# Altium schematic sheet Comms.SchDoc
size A
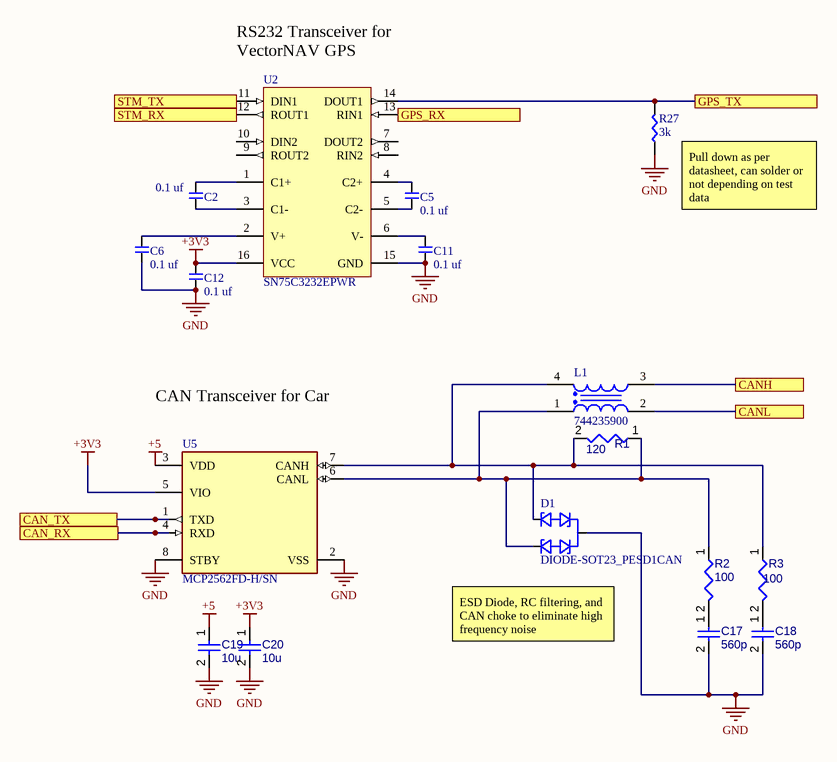
[diagram p0: Comms.SchDoc]

## Parts
C2  0.1 uf  [CAP-0603]
C5  0.1 uf  [CAP-0603]
C6  0.1 uf  [CAP-0603]
C11  0.1 uf  [CAP-0603]
C12  0.1 uf  [CAP-0603]
C17  560p  [CAPC0603(1608)100_L]
C18  560p  [CAPC0603(1608)100_L]
C19  10u  [CAPC0603(1608)100_L]
C20  10u  [CAPC0603(1608)100_L]
D1  DIODE-SOT23_PESD1CAN  [SOT23]
L1  744235900  [WE-CNSW_1812]
R1  120  [RESC0805(2012)_L]
R2  100  [RESC0805(2012)_L]
R3  100  [RESC0805(2012)_L]
R27  3k  [RES-0603]
U2  SN75C3232EPWR  [PW0016A_M]
U5  MCP2562FD-H/SN  [FP-C04-057-SN-MFG]

## Ports
CAN_RX, CAN_TX, CANH, CANL, GPS_RX, GPS_TX, STM_RX, STM_TX

## Nets
+3V3: C12.1 C20.1 U2.16(VCC) U5.5(VIO)
+5: C19.1 U5.3(VDD)
GND: C6.2 C11.2 C12.2 C17.2 C18.2 C19.2 C20.2 D1.3(G) R27.1 U2.15(GND) U5.2(VSS) U5.8(STBY)
CAN_RX: U5.4(RXD) ; port CAN_RX
CAN_TX: U5.1(TXD) ; port CAN_TX
CANH: L1.3 ; port CANH
CANL: L1.2 ; port CANL
GPS_RX: U2.13(RIN1) ; port GPS_RX
GPS_TX: R27.2 U2.14(DOUT1) ; port GPS_TX
STM_RX: U2.12(ROUT1) ; port STM_RX
STM_TX: U2.11(DIN1) ; port STM_TX
NetC2_1: C2.1 U2.1(C1+)
NetC2_2: C2.2 U2.3(C1-)
NetC5_1: C5.1 U2.4(C2+)
NetC5_2: C5.2 U2.5(C2-)
NetC6_1: C6.1 U2.2(V+)
NetC11_1: C11.1 U2.6(V-)
NetC17_1: C17.1 R2.2
NetC18_1: C18.1 R3.2
NetD1_1: D1.1(CAN1) L1.4 R1.2 R3.1 U5.7(CANH)
NetD1_2: D1.2(CAN2) L1.1 R1.1 R2.1 U5.6(CANL)

Not connected (* = marked no-connect by the designer): U2 7(DOUT2) 8(RIN2) 9(ROUT2) 10(DIN2)

## Notes on the sheet
- (near U2) RS232 Transceiver for VectorNAV GPS
- (near R27) Pull down as per datasheet, can solder or not depending on test data
- CAN Transceiver for Car
- (near D1) ESD Diode, RC filtering, and CAN choke to eliminate high frequency noise

## Library data of the parts
C2 C5 C6 C11 C12 = CMP-009-000303-1: Source: ife19_Elec_Library.SchLib; Design Item ID: CAP-0603
C17-C20 = CMP-005-000563-1: Chip Capacitor, 1 uF, +/- 10%, 16 V, 0603 (1608 Metric); Voltage Rating: 16V; Capacitor Type: Ceramic; Value: 1µF; Available Preview Images: 2D; Pins: 2; Tolerance: 10%; Mounting Technology: SM; RoHS Compliant: True; Case/Package: 0603; Max Operating Temperature: 125°C; Min Operating Temperature: -55°C; Source: Integrated_Library - 12.03.21 - 15.39.SchLib; Design Item ID: CMP-001-00003-4
D1 = CMP-051-000170-1: Source: ife19_Elec_Library.SchLib; Design Item ID: DIODE-SOT23_PESD1CAN
L1 = CMP-1372-00007-2: NexarPartId: 24746530; Core Material: Ferrite; Max DC Current: 2A; Number of Lines: 2; Voltage Rating (AC): 50V; Impedance: 90Ω; Voltage Rating: 60V; DC Resistance (DCR): 50mΩ; Inductance: 300nH; Tolerance: 25%; Height: 2.8mm; Mount: Surface Mount; Packaging: Digi-Reel®; Termination: SMD/SMT; Ambient Temperature Range Low: -40°C; REACH SVHC: No SVHC; Length: 4.5mm; Width: 3.2mm; Number of Pins: 4; Ambient Temperature Range High: 85°C; RoHS: Compliant; Depth: 3.2mm; Current: 2A; Voltage Rating (DC): 50V; Max Operating Temperature: 125°C; Case/Package: 1812; Min Operating Temperature: -40°C; Current Rating: 2A; Resistance: 50mΩ
R1-R3 = CMP-009-000172-1
R27 = CMP-014-000032-1: Source: ife19_Elec_Library.SchLib; Design Item ID: RES-0603
U2 = CMP-0299-01607-2: 3-V to 5.5-V Two-Channel RS-232 1-Mbit/s Line Driver / Receiver with ±15-kV IEC ESD Protection, 0 to 70 degC, 16-Pin TSSOP (PW), Green (RoHS & no Sb/Br); Receivers Per Package: 2; IEC-61000-4-2 SUPPORT: TRUE; ESD HBM(kV): +/-15; Supply Voltage(s)(V): 3.3 or 5.0; ICC(Max)(mA): 1; ComponentLink1URL: www.ti.com; ComponentLink3URL: http://www.ti.com/litv/pdf/mpds361; PackageVersion: revG, Feb-2011; PackageReference: PW0016A; Drivers Per Package: 2; ComponentLink2Description: Datasheet; SubFamily: RS-232; ComponentLink3Description: Package Specification; Single Supply: TRUE; RS-232: TRUE; ComponentLink1Description: Manufacturer URL; ComponentLink2URL: http://www.ti.com/general/docs/lit/getliterature.tsp?genericPartNumber=SN75C3232E&fileType=pdf; PackageDescription: 16-Pin Plastic Thin Small Outline Package 5 x 4.4 mm Body ,0.65 mm Pitch; DatasheetVersion: SLLS697A
U5 = CMP-06279-000024-1: IC TRANSCEIVER 1/1 8SOIC; Max Supply Voltage: 5.5V; Number of Transceivers: 1; Receiver Hysteresis: 200mV; Operating Supply Current: 70mA; Min Supply Voltage: 4.5V; Data Rate: 8Mbps; Package Quantity: 100; Series: -; Case/Package: SOIC; Max Operating Temperature: 150°C; Packaging: Rail/Tube; Min Operating Temperature: -40°C; RoHS Compliant: Yes; Mount: Surface Mount; Weight: 0.019048oz; Number of Pins: 8